# EAGLE design control_board (EAGLE 6.3)
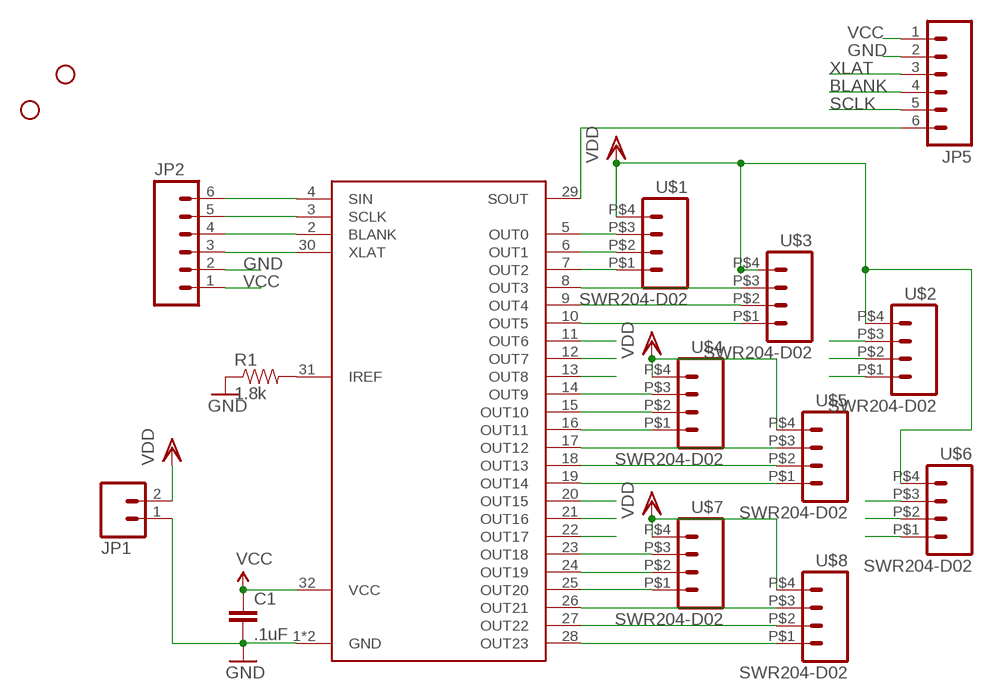
[diagram p0: schematic, sheet 1]

## Parts
C1  .1uF  CAP0603-CAP  [0603-CAP]
JP1  M02-JST-2MM-SMT  [JST-2-SMD]
JP2  M06LOCK  [1X06_LOCK]
JP5  M06LOCK  [1X06_LOCK]
R1  1.8k  RESISTOR0603-RES  [0603-RES]
STANDOFF2  STAND-OFF  [STAND-OFF]
STANDOFF3  STAND-OFF  [STAND-OFF]
TLC5947  TLC5947DAP  [DAP]
U$1  SWR204-D02  [SWR204]
U$2  SWR204-D02  [SWR204]
U$3  SWR204-D02  [SWR204]
U$4  SWR204-D02  [SWR204]
U$5  SWR204-D02  [SWR204]
U$6  SWR204-D02  [SWR204]
U$7  SWR204-D02  [SWR204]
U$8  SWR204-D02  [SWR204]

## Nets
BLANK: JP2.4 JP5.4 TLC5947.2(BLANK)
GND: C1.2 JP1.1 JP2.2 JP5.2 R1.1 TLC5947.1(GND) TLC5947.GND
N$1: R1.2 TLC5947.31(IREF)
OUT0: TLC5947.5(OUT0) U$1.P$3
OUT1: TLC5947.6(OUT1) U$1.P$2
OUT2: TLC5947.7(OUT2) U$1.P$1
OUT3: TLC5947.8(OUT3) U$3.P$3
OUT4: TLC5947.9(OUT4) U$3.P$2
OUT5: TLC5947.10(OUT5) U$3.P$1
OUT6: TLC5947.11(OUT6) U$2.P$3
OUT7: TLC5947.12(OUT7) U$2.P$2
OUT8: TLC5947.13(OUT8) U$2.P$1
OUT9: TLC5947.14(OUT9) U$4.P$3
OUT10: TLC5947.15(OUT10) U$4.P$2
OUT11: TLC5947.16(OUT11) U$4.P$1
OUT12: TLC5947.17(OUT12) U$5.P$3
OUT13: TLC5947.18(OUT13) U$5.P$2
OUT14: TLC5947.19(OUT14) U$5.P$1
OUT15: TLC5947.20(OUT15) U$6.P$3
OUT16: TLC5947.21(OUT16) U$6.P$2
OUT17: TLC5947.22(OUT17) U$6.P$1
OUT18: TLC5947.23(OUT18) U$7.P$3
OUT19: TLC5947.24(OUT19) U$7.P$2
OUT20: TLC5947.25(OUT20) U$7.P$1
OUT21: TLC5947.26(OUT21) U$8.P$3
OUT22: TLC5947.27(OUT22) U$8.P$2
OUT23: TLC5947.28(OUT23) U$8.P$1
SCLK: JP2.5 JP5.5 TLC5947.3(SCLK)
SIN: JP2.6 TLC5947.4(SIN)
SOUT: JP5.6 TLC5947.29(SOUT)
VCC: C1.1 JP2.1 JP5.1 TLC5947.32(VCC)
VDD: JP1.2 U$1.P$4 U$2.P$4 U$3.P$4 U$4.P$4 U$5.P$4 U$6.P$4 U$7.P$4 U$8.P$4
XLAT: JP2.3 JP5.3 TLC5947.30(XLAT)

## Library data of the parts
C1 = SparkFun-Capacitors:CAP: Capacitor Standard 0603 ceramic capacitor, and 0.1" leaded capacitor.
JP1 = SparkFun-Connectors:M02: Header 2 Standard 2-pin 0.1" header. Use with straight break away headers (SKU : PRT-00116), right angle break away headers (PRT-00553), swiss pins (PRT-00743), machine pins (PRT-00117), and female headers (PRT-00115). Molex polarized connector foot print use with SKU : PRT-08233 with associated crimp pins and housings.; PROD_ID: CONN-08352
JP2 JP5 = SparkFun-Connectors:M06: Header 6 Standard 6-pin 0.1" header. Use with straight break away headers (SKU : PRT-00116), right angle break away headers (PRT-00553), swiss pins (PRT-00743), machine pins (PRT-00117), and female headers (PRT-00115). Molex polarized connector foot print use with SKU : PRT-08094 with associated crimp pins and housings. NOTES ON THE VARIANTS LOCK and LOCK_LONGPADS... This footprint was designed to help hold the alignment of a through-hole component (i.e. 6-pin header) while soldering it into place. You may notice that each hole has been shifted either up or down by 0.005 of an inch from it's more standard position (which is a perfectly straight line). This slight alteration caused the pins (the squares in the middle) to touch the edges of the holes. Because they are alternating, it causes a "brace" to hold the component in place. 0.005 has proven to be the perfect amount of "off-center" position when using our standard breakaway headers. Although looks a little odd when you look at the bare footprint, once you have a header in there, the alteration is very hard to notice. Also, if you push a header all the way into place, it is covered up entirely on the bottom side. This idea of altering the position of holes to aid alignment will be further integrated into the Sparkfun Library for other footprints. It can help hold any component with 3 or more connection pins.
R1 = SparkFun-Resistors:RESISTOR: Resistor Basic schematic elements and footprints for 0603, 1206, and PTH resistors.
STANDOFF2 STANDOFF3 = SparkFun-Electromechanical:STAND-OFF: #4 Stand Off This is the mechanical footprint for a #4 phillips button head screw. Use the keepout ring to avoid running the screw head into surrounding components. SKU : PRT-00447
TLC5947 = SparkFun-DigitalIC:TLC5947
U$1-U$8 = SparkFun-Connectors:SWR204-D02

## Board
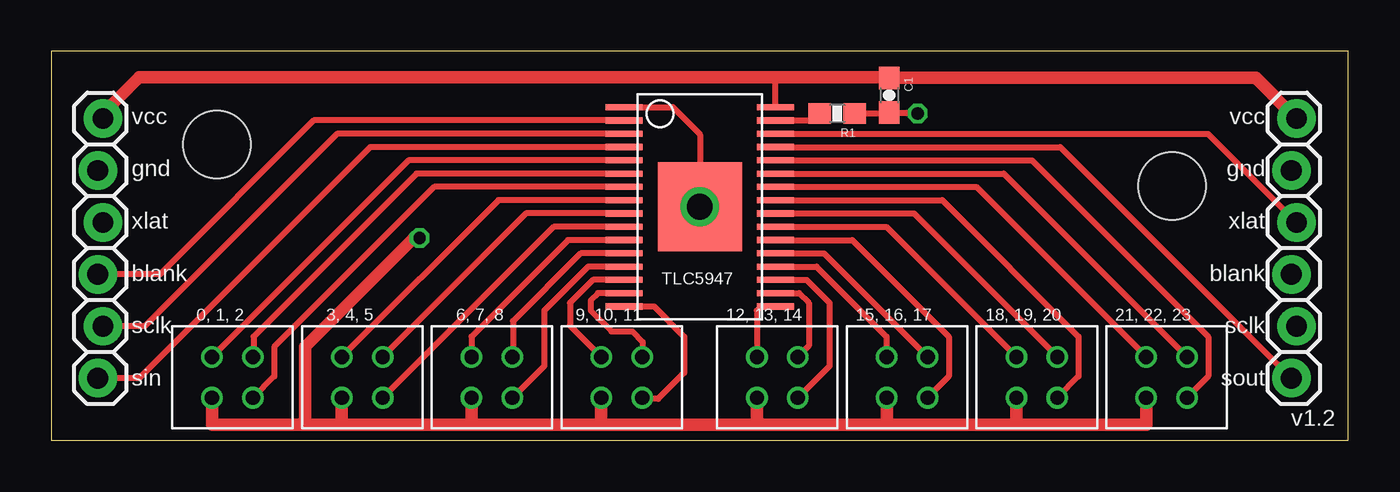
[diagram p1: board, top side]
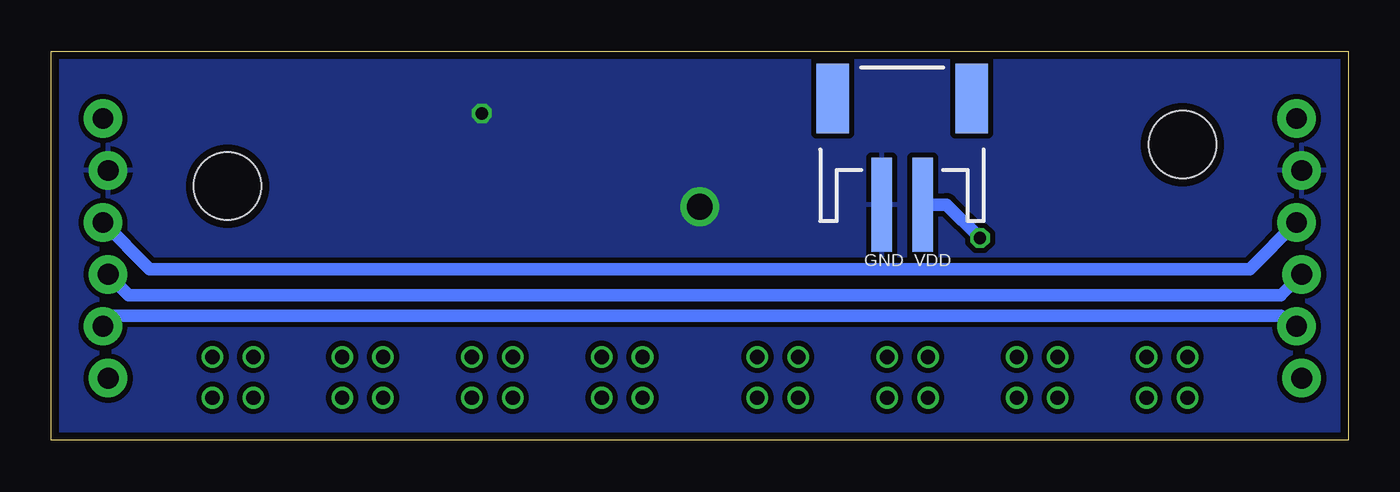
[diagram p2: board, bottom side, seen from below]

Size 63.5 x 19.05 mm. Coordinates in mm from the lower left corner, seen from the top.
Outline: 0,0 63.5,0 63.5,19.05 0,19.05 0,0
Copper layers (1*16): Top 0.0356mm / dielectric 1.5011mm / Bottom 0.0356mm
Design rules "LaenPCBOrder *": minimum track width 6mil, minimum drill 13mil, track to track 10mil, track to pad 6mil, pad to pad 6mil, via to via 6mil, smd to smd 6mil, copper to edge 15mil, drill to drill 6mil, minimum pad ring 7mil, minimum via ring 7mil, stop-mask expansion 4mil, vias tented up to drill 0mil, thermal gap 10mil

### Footprints (pad centres in the part's own frame; a part is rotated, then mirrored left to right if it is on the bottom)
0603-CAP = smd 1.1 x 1: 1 -0.85,0; 2 0.85,0
JST-2-SMD = smd 1 x 4.6: 1 -1,-3.7; 2 1,-3.7 | smd 1.6 x 3.4: NC1 -3.4,1.5; NC2 3.4,1.5
1X06_LOCK = drill 1.016 pad 1.88: 1 0,0; 2 2.54,-0.254; 3 5.08,0; 4 7.62,-0.254; 5 10.16,0; 6 12.7,-0.254
0603-RES = smd 1.1 x 1: 1 -0.85,0; 2 0.85,0
STAND-OFF = hole 3.302: 0,0
DAP = smd 0.3 x 1.8: 1 -4.875,-3.7; 2 -4.225,-3.7; 3 -3.575,-3.7; 4 -2.925,-3.7; 5 -2.275,-3.7; 6 -1.625,-3.7; 7 -0.975,-3.7; 8 -0.325,-3.7; 9 0.325,-3.7; 10 0.975,-3.7; 11 1.625,-3.7; 12 2.275,-3.7; 13 2.925,-3.7; 14 3.575,-3.7; 15 4.225,-3.7; 16 4.875,-3.7; 17 4.875,3.7; 18 4.225,3.7; 19 3.575,3.7; 20 2.925,3.7; 21 2.275,3.7; 22 1.625,3.7; 23 0.975,3.7; 24 0.325,3.7; 25 -0.325,3.7; 26 -0.975,3.7; 27 -1.625,3.7; 28 -2.275,3.7; 29 -2.925,3.7; 30 -3.575,3.7; 31 -4.225,3.7; 32 -4.875,3.7 | smd 4.36 x 4.11: GND 0,0
SWR204 = drill 0.7: P$1 -0.99,0.96; P$2 -0.99,-1.04; P$3 1.01,-1.04; P$4 1.01,0.96

### Placement (x,y rotation side)
C1  41.02,16.89 270 top
JP1  21.84,15.24 0 bottom
JP2  2.54,15.75 270 top
JP5  60.96,15.75 270 top
R1  38.48,16 180 top
STANDOFF2  8.13,14.48 0 top
STANDOFF3  54.86,12.45 0 top
TLC5947  31.75,11.43 270 top
U$1  8.89,3.05 180 top
U$2  21.59,3.05 180 top
U$3  15.24,3.05 180 top
U$4  27.94,3.05 180 top
U$5  35.56,3.05 180 top
U$6  41.91,3.05 180 top
U$7  48.26,3.05 180 top
U$8  54.61,3.05 180 top

### Tracks (layer width: path | path; a pad name or v marks a point on that pad's centre or on a via)
BLANK
  Top 0.305: TLC5947.2 12.86,15.65 5.33,8.13 JP2.4
  Bottom 0.61: JP2.4 3.3,7.11 59.69,7.11 JP5.4
GND  (via drill 0.6, 1.27)
  Top 0.305: TLC5947.1 30.43,16.3 31.75,14.99 TLC5947.GND | R1.1 40.98,16 C1.2 42.38,16.04 v42.42,16
  other vias: 31.75,11.43
  pour Bottom: 0,0 0,19.05 63.5,19.05 63.5,0
N$1
  Top 0.305: TLC5947.31 37.28,15.65 R1.2
OUT0
  Top 0.305: TLC5947.5 17.5,13.71 U$1.P$3
OUT1
  Top 0.305: TLC5947.6 17.88,13.05 9.91,5.08 9.91,4.11 U$1.P$2
OUT2
  Top 0.305: TLC5947.7 18.75,12.4 10.92,4.57 10.92,3.13 U$1.P$1
OUT3
  Top 0.305: TLC5947.8 21.9,11.76 U$3.P$3
OUT4
  Top 0.305: TLC5947.9 23.25,11.11 U$3.P$2
OUT5
  Top 0.305: TLC5947.10 24.6,10.46 U$3.P$1
OUT6
  Top 0.305: TLC5947.11 25.3,9.8 20.57,5.08 U$2.P$3
OUT7
  Top 0.305: TLC5947.12 25.92,9.15 22.61,5.84 22.61,4.11 U$2.P$2
OUT8
  Top 0.305: TLC5947.13 26.29,8.51 24.13,6.35 24.13,3.64 U$2.P$1
OUT9
  Top 0.305: TLC5947.14 26.52,7.86 25.4,6.73 25.4,5.62 U$4.P$3
OUT10
  Top 0.305: TLC5947.15 26.76,7.21 26.42,6.86 26.42,6.35 27.43,5.33 28.45,5.33 28.96,4.83 28.96,4.11 U$4.P$2
OUT11
  Top 0.305: TLC5947.16 29.51,6.55 30.99,5.08 30.99,3.3 29.72,2.03 28.99,2.03 U$4.P$1
OUT12
  Top 0.305: TLC5947.17 34.75,6.55 34.54,6.35 U$5.P$3
OUT13
  Top 0.305: TLC5947.18 36.61,7.21 37.08,6.73 37.08,4.62 U$5.P$2
OUT14
  Top 0.305: TLC5947.19 36.98,7.86 38.1,6.73 38.1,3.64 U$5.P$1
OUT15
  Top 0.305: TLC5947.20 37.47,8.51 40.89,5.08 U$6.P$3
OUT16
  Top 0.305: TLC5947.21 37.83,9.15 U$6.P$2
OUT17
  Top 0.305: TLC5947.22 39.22,9.8 43.94,5.08 43.94,3.13 U$6.P$1
OUT18
  Top 0.305: TLC5947.23 40.88,10.46 U$7.P$3
OUT19
  Top 0.305: TLC5947.24 42.23,11.11 U$7.P$2
OUT20
  Top 0.305: TLC5947.25 43.62,11.76 50.29,5.08 50.29,3.13 U$7.P$1
OUT21
  Top 0.305: TLC5947.26 45.28,12.4 U$8.P$3
OUT22
  Top 0.305: TLC5947.27 46.63,13.05 U$8.P$2
OUT23
  Top 0.305: TLC5947.28 48.02,13.71 56.64,5.08 56.64,3.13 U$8.P$1
SCLK
  Top 0.305: TLC5947.3 13.99,15.01 4.57,5.59 JP2.5
  Bottom 0.61: JP2.5 2.79,5.59 3.3,6.1 60.45,6.1 JP5.5
SIN
  Top 0.305: TLC5947.4 15.62,14.36 4.32,3.05 JP2.6
SOUT
  Top 0.305: TLC5947.29 49.4,14.36 JP5.6
VCC
  Top 0.305: TLC5947.32 35.45,17.67 35.56,17.78
  Top 0.61: JP2.1 2.54,16 4.32,17.78 35.56,17.78 40.98,17.78 C1.1 58.97,17.74 JP5.1
VDD  (via drill 0.6)
  Top 0.61: 49.78,0.76 53.59,0.76 53.6,0.77 U$8.P$4 | 49.78,0.76 47.24,0.76 | 47.24,0.76 42.16,0.76 | 42.16,0.76 40.89,0.76 | 40.89,0.76 34.8,0.76 | 34.8,0.76 26.92,0.76 | 26.92,0.76 20.57,0.76 | 20.57,0.76 19.3,0.76 | 19.3,0.76 14.22,0.76 | 14.22,0.76 12.19,0.76 | 12.19,0.76 11.68,0.76 | 11.68,0.76 7.87,0.76 7.88,0.77 U$1.P$4 | 11.69,0.77 11.68,0.76 | 19.31,0.77 19.3,0.76 | 34.8,0.76 34.55,1.01 U$5.P$4 | 42.17,0.77 42.16,0.76 | 49.79,0.77 49.78,0.76 | U$7.P$4 47.25,0.77 47.24,0.76 | U$6.P$4 40.9,0.77 40.89,0.76 | U$4.P$4 26.93,0.77 26.92,0.76 | U$2.P$4 20.58,0.77 20.57,0.76 | U$3.P$4 14.23,0.77 14.22,0.76 | v18.03,9.91 17.78,9.91 12.45,4.57 12.45,1.02 12.19,0.76
  Bottom 0.61: JP1.2 19.67,11.54 v18.03,9.91
XLAT
  Top 0.305: TLC5947.30 56.62,15.01 JP5.3
  Bottom 0.61: JP2.3 4.83,8.38 58.67,8.38 JP5.3

### Text on the board
tPlace: vcc / gnd / xlat / blank / sclk / sin | vcc / gnd / xlat / blank / sclk / sout | v1.2
bPlace: GND VDD
tNames: 0, 1, 2 | 3, 4, 5 | 6, 7, 8 | 9, 10, 11 | 12, 13, 14 | 15, 16, 17 | 18, 19, 20 | 21, 22, 23